# EAGLE schematic light_controller (EAGLE 9.2.2)
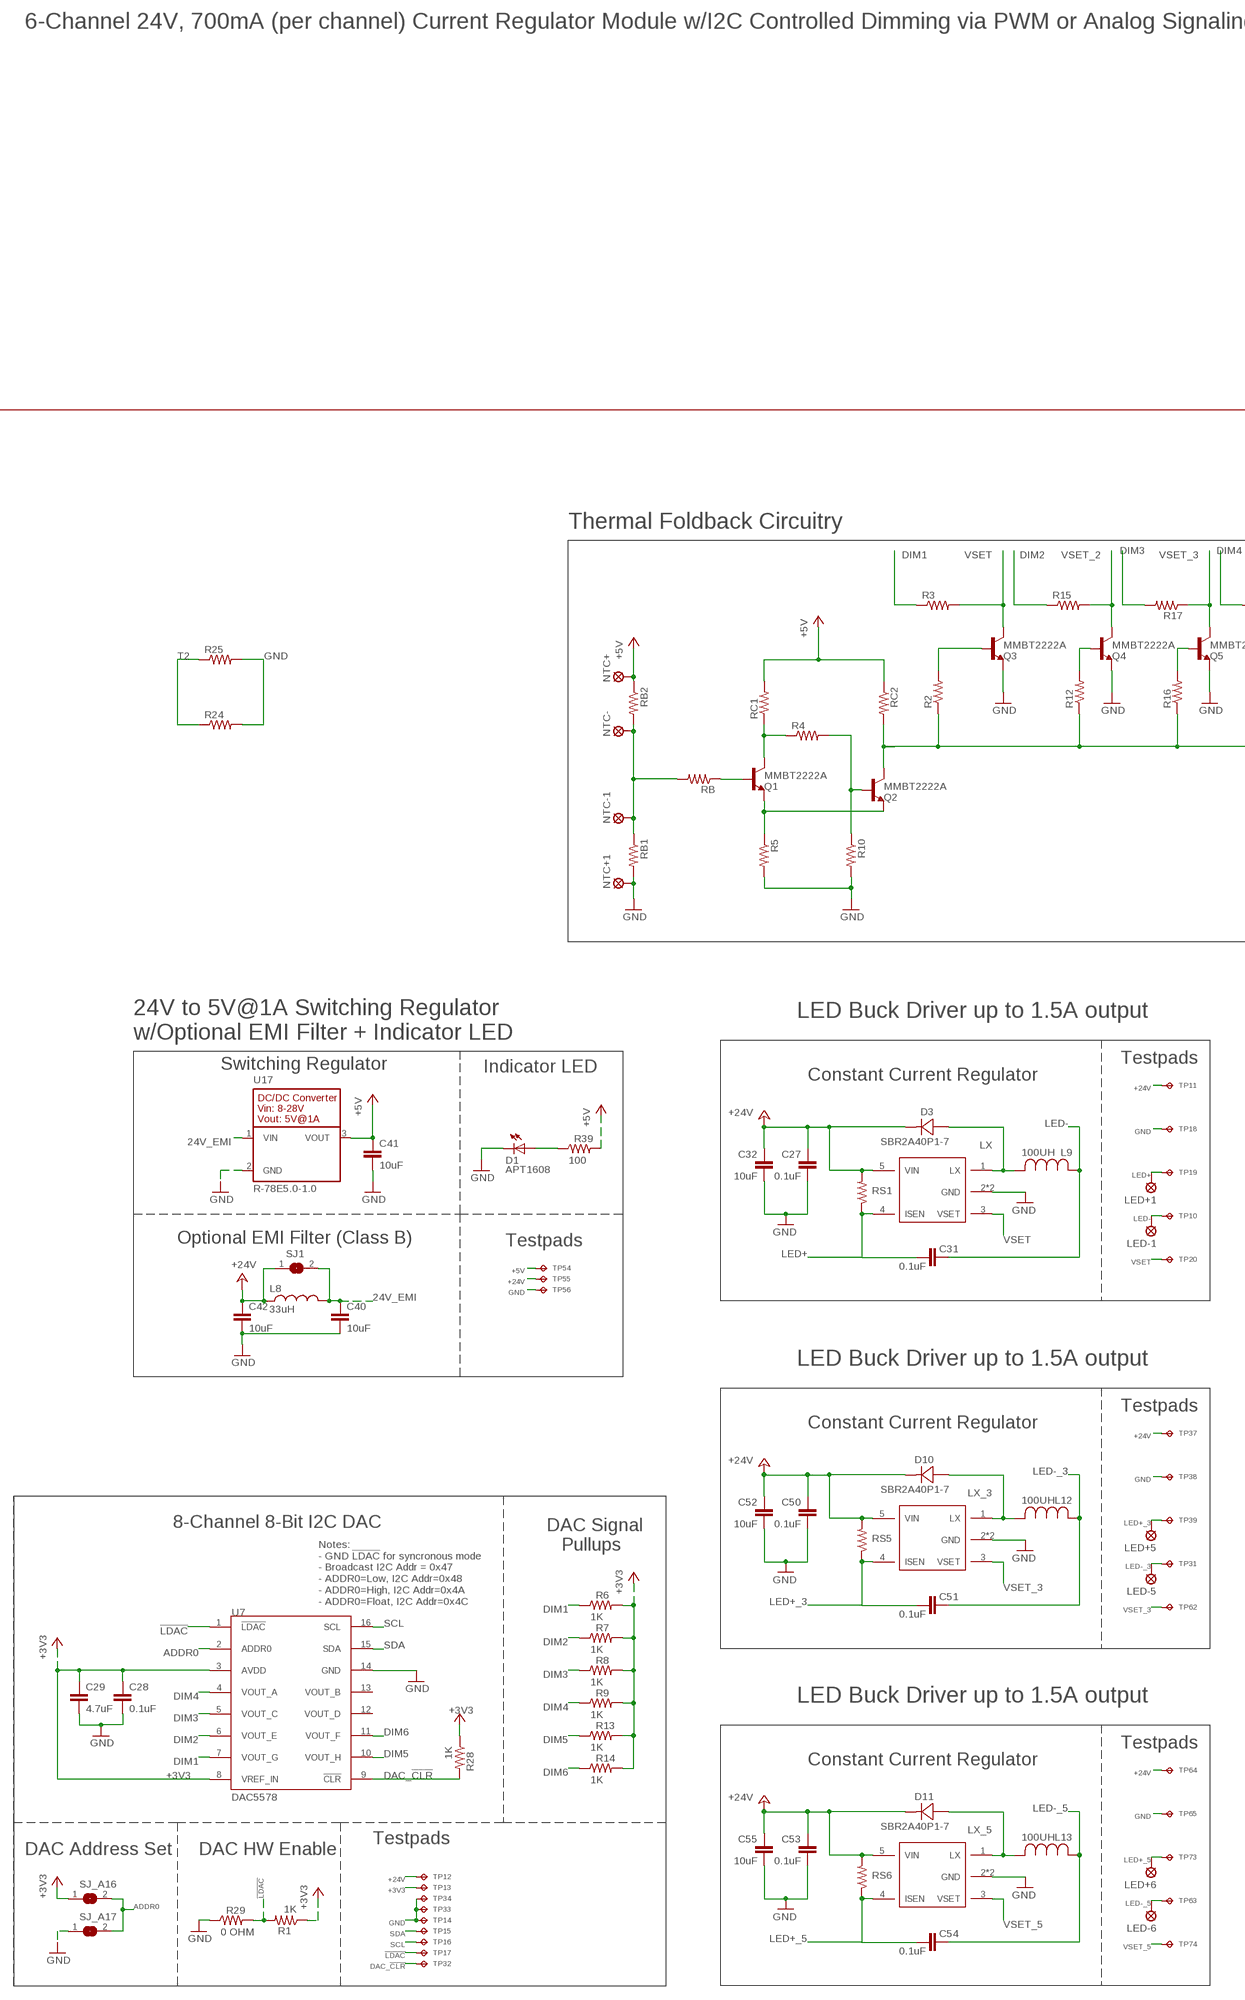
[diagram p0: schematic, sheet 1, part 1 of 2]
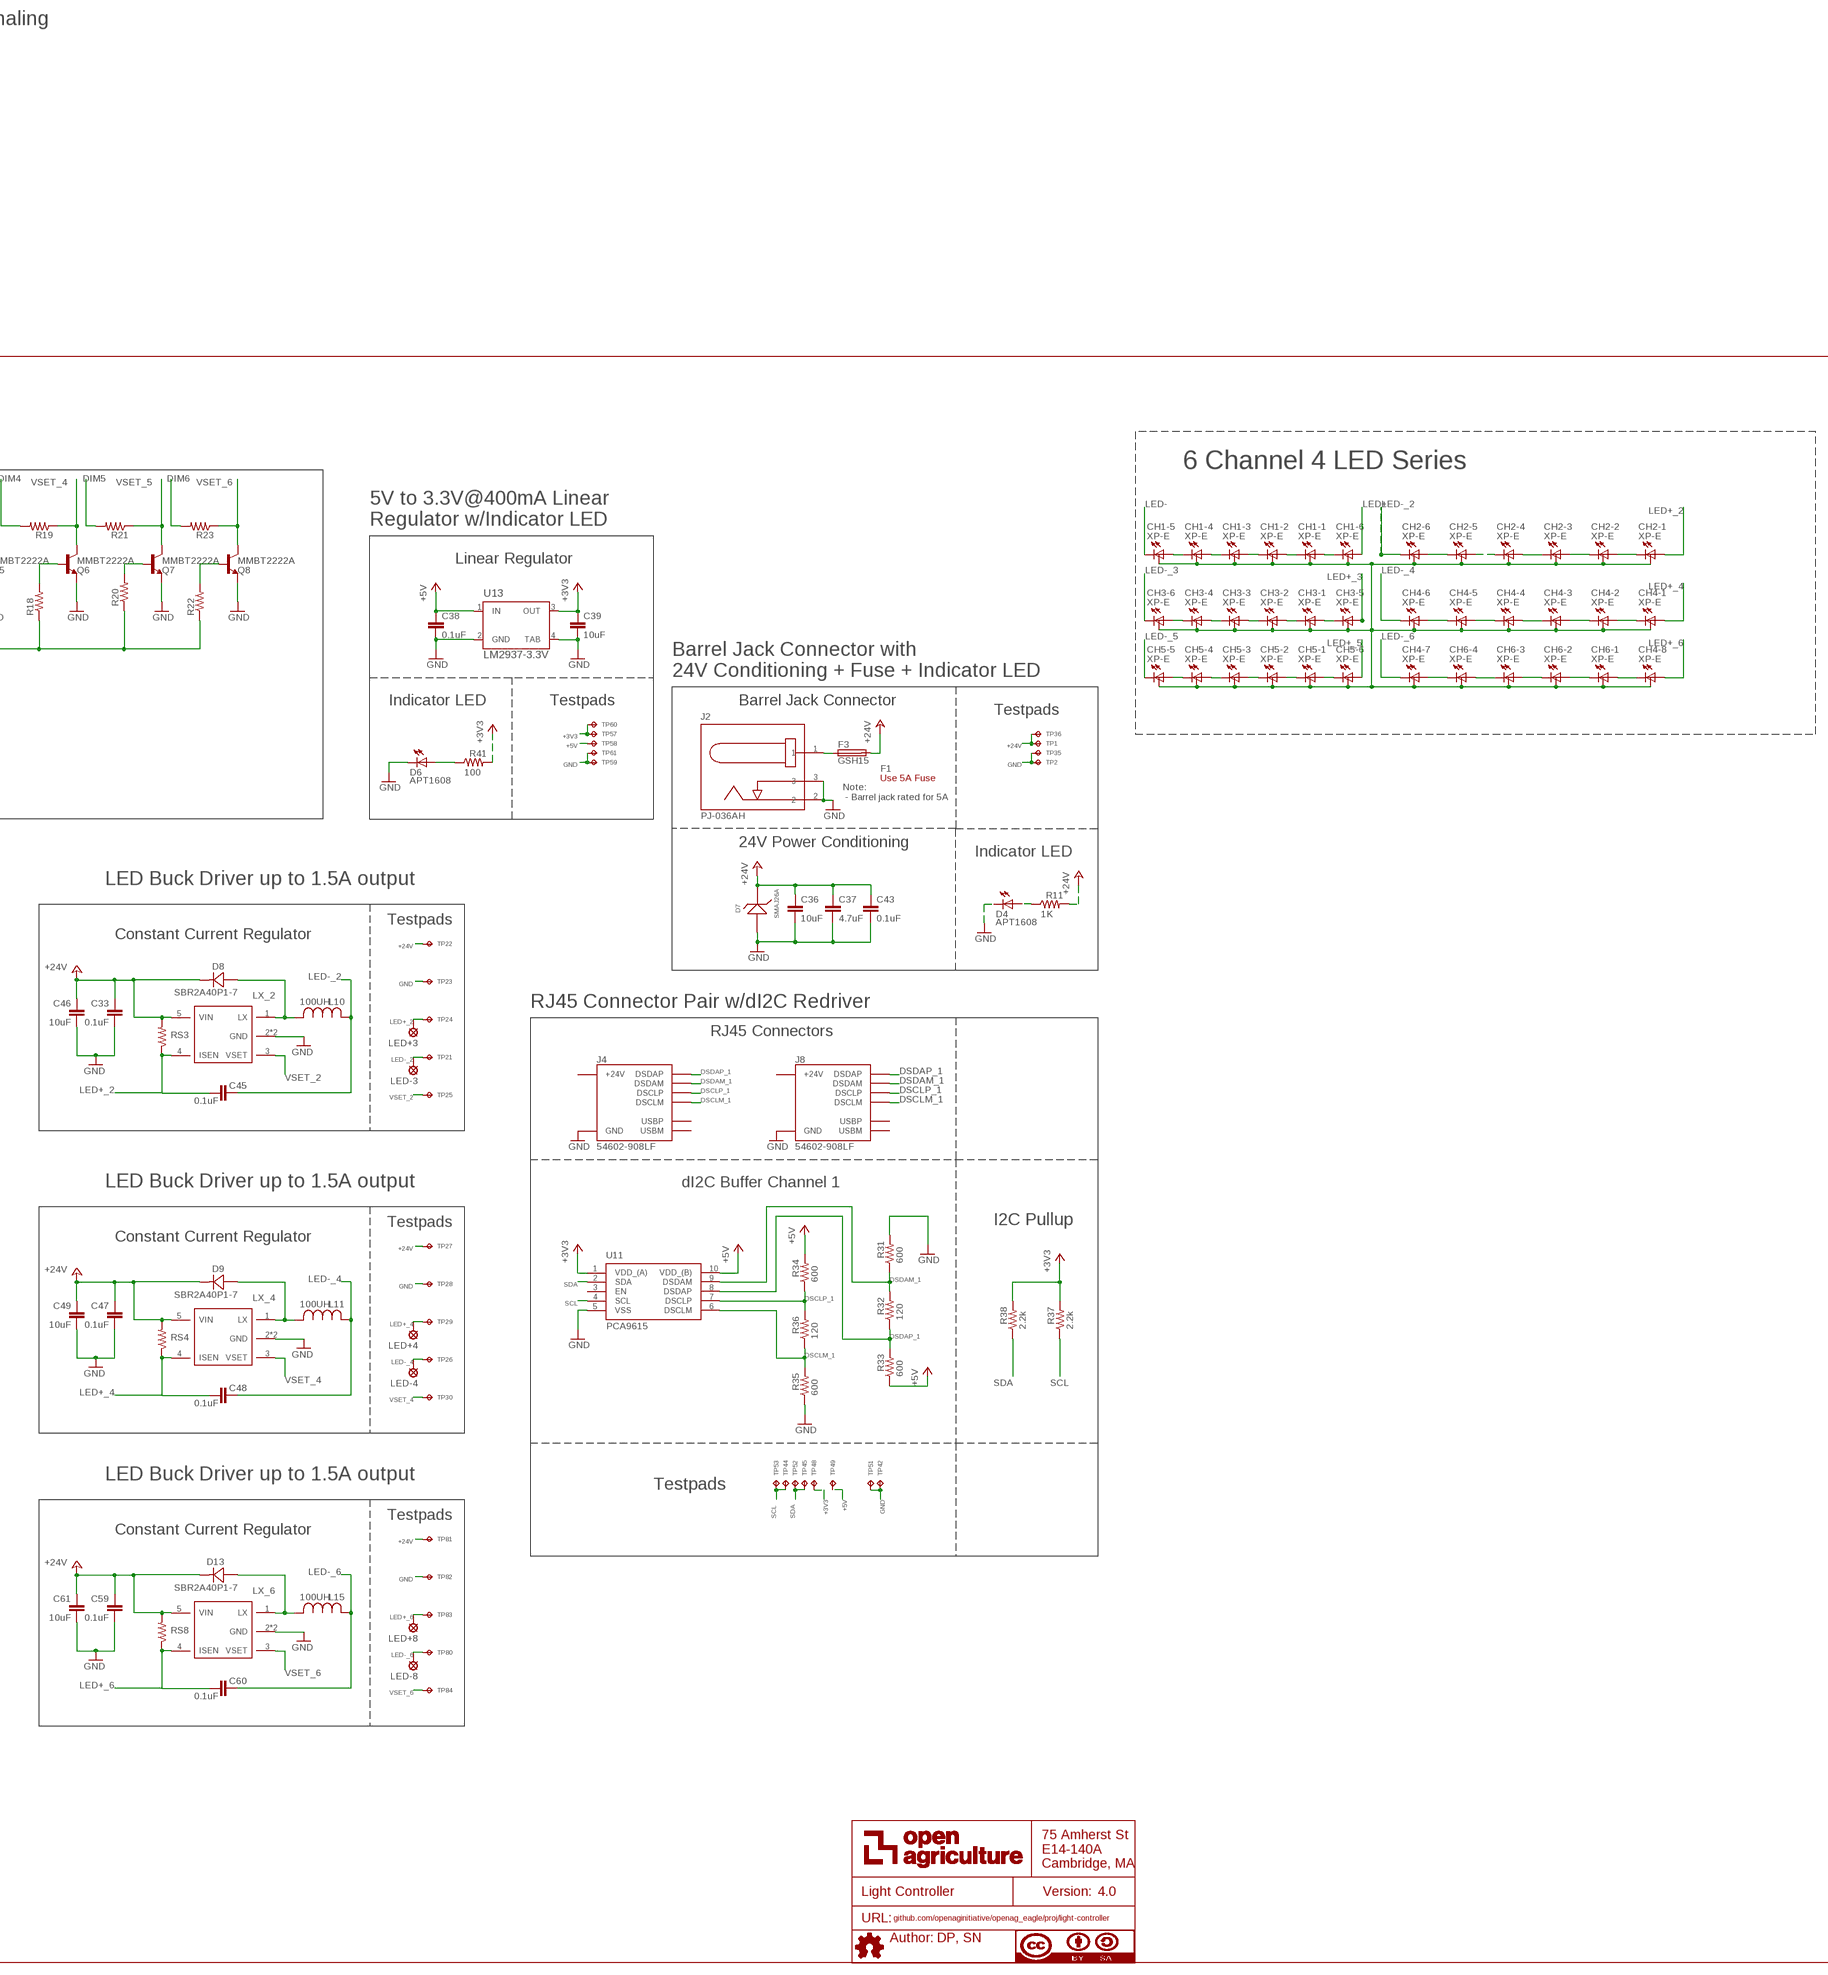
[diagram p1: schematic, sheet 1, part 2 of 2]

## Parts
C27  0.1uF  0.1UF-C0603C104K5RACTU  [C0603]
C28  0.1uF  0.1UF-C0603C104K5RACTU  [C0603]
C29  4.7uF  4.7UF-CL21A475KBQNNNE  [C0805]
C31  0.1uF  0.1UF-C0603C104K5RACTU  [C0603]
C32  10uF  10UF-GMK212BBJ106KG-T  [C0805]
C33  0.1uF  0.1UF-C0603C104K5RACTU  [C0603]
C36  10uF  10UF-GMK212BBJ106KG-T  [C0805]
C37  4.7uF  4.7UF-CL21A475KBQNNNE  [C0805]
C38  0.1uF  0.1UF-C0603C104K5RACTU  [C0603]
C39  10uF  10UF-GMK212BBJ106KG-T  [C0805]
C40  10uF  10UF-GMK212BBJ106KG-T  [C0805]
C41  10uF  10UF-GMK212BBJ106KG-T  [C0805]
C42  10uF  10UF-GMK212BBJ106KG-T  [C0805]
C43  0.1uF  0.1UF-C0603C104K5RACTU  [C0603]
C45  0.1uF  0.1UF-C0603C104K5RACTU  [C0603]
C46  10uF  10UF-GMK212BBJ106KG-T  [C0805]
C47  0.1uF  0.1UF-C0603C104K5RACTU  [C0603]
C48  0.1uF  0.1UF-C0603C104K5RACTU  [C0603]
C49  10uF  10UF-GMK212BBJ106KG-T  [C0805]
C50  0.1uF  0.1UF-C0603C104K5RACTU  [C0603]
C51  0.1uF  0.1UF-C0603C104K5RACTU  [C0603]
C52  10uF  10UF-GMK212BBJ106KG-T  [C0805]
C53  0.1uF  0.1UF-C0603C104K5RACTU  [C0603]
C54  0.1uF  0.1UF-C0603C104K5RACTU  [C0603]
C55  10uF  10UF-GMK212BBJ106KG-T  [C0805]
C59  0.1uF  0.1UF-C0603C104K5RACTU  [C0603]
C60  0.1uF  0.1UF-C0603C104K5RACTU  [C0603]
C61  10uF  10UF-GMK212BBJ106KG-T  [C0805]
CH1-1  XP-E  LED_W/THERM-XP-E  [CREE-XLAMP-XP-E]
CH1-2  XP-E  LED_W/THERM-XP-E  [CREE-XLAMP-XP-E]
CH1-3  XP-E  LED_W/THERM-XP-E  [CREE-XLAMP-XP-E]
CH1-4  XP-E  LED_W/THERM-XP-E  [CREE-XLAMP-XP-E]
CH1-5  XP-E  LED_W/THERM-XP-E  [CREE-XLAMP-XP-E]
CH1-6  XP-E  LED_W/THERM-XP-E  [CREE-XLAMP-XP-E]
CH2-1  XP-E  LED_W/THERM-XP-E  [CREE-XLAMP-XP-E]
CH2-2  XP-E  LED_W/THERM-XP-E  [CREE-XLAMP-XP-E]
CH2-3  XP-E  LED_W/THERM-XP-E  [CREE-XLAMP-XP-E]
CH2-4  XP-E  LED_W/THERM-XP-E  [CREE-XLAMP-XP-E]
CH2-5  XP-E  LED_W/THERM-XP-E  [CREE-XLAMP-XP-E]
CH2-6  XP-E  LED_W/THERM-XP-E  [CREE-XLAMP-XP-E]
CH3-1  XP-E  LED_W/THERM-XP-E  [CREE-XLAMP-XP-E]
CH3-2  XP-E  LED_W/THERM-XP-E  [CREE-XLAMP-XP-E]
CH3-3  XP-E  LED_W/THERM-XP-E  [CREE-XLAMP-XP-E]
CH3-4  XP-E  LED_W/THERM-XP-E  [CREE-XLAMP-XP-E]
CH3-5  XP-E  LED_W/THERM-XP-E  [CREE-XLAMP-XP-E]
CH3-6  XP-E  LED_W/THERM-XP-E  [CREE-XLAMP-XP-E]
CH4-1  XP-E  LED_W/THERM-XP-E  [CREE-XLAMP-XP-E]
CH4-2  XP-E  LED_W/THERM-XP-E  [CREE-XLAMP-XP-E]
CH4-3  XP-E  LED_W/THERM-XP-E  [CREE-XLAMP-XP-E]
CH4-4  XP-E  LED_W/THERM-XP-E  [CREE-XLAMP-XP-E]
CH4-5  XP-E  LED_W/THERM-XP-E  [CREE-XLAMP-XP-E]
CH4-6  XP-E  LED_W/THERM-XP-E  [CREE-XLAMP-XP-E]
CH4-7  XP-E  LED_W/THERM-XP-E  [CREE-XLAMP-XP-E]
CH4-8  XP-E  LED_W/THERM-XP-E  [CREE-XLAMP-XP-E]
CH5-1  XP-E  LED_W/THERM-XP-E  [CREE-XLAMP-XP-E]
CH5-2  XP-E  LED_W/THERM-XP-E  [CREE-XLAMP-XP-E]
CH5-3  XP-E  LED_W/THERM-XP-E  [CREE-XLAMP-XP-E]
CH5-4  XP-E  LED_W/THERM-XP-E  [CREE-XLAMP-XP-E]
CH5-5  XP-E  LED_W/THERM-XP-E  [CREE-XLAMP-XP-E]
CH5-6  XP-E  LED_W/THERM-XP-E  [CREE-XLAMP-XP-E]
CH6-1  XP-E  LED_W/THERM-XP-E  [CREE-XLAMP-XP-E]
CH6-2  XP-E  LED_W/THERM-XP-E  [CREE-XLAMP-XP-E]
CH6-3  XP-E  LED_W/THERM-XP-E  [CREE-XLAMP-XP-E]
CH6-4  XP-E  LED_W/THERM-XP-E  [CREE-XLAMP-XP-E]
D1  APT1608  APT1608CGCK  [CHIPLED_0603]
D3  SBR2A40P1-7  [POWERDI123]
D4  APT1608  APT1608CGCK  [CHIPLED_0603]
D6  APT1608  APT1608CGCK  [CHIPLED_0603]
D7  SMAJ26A  SMAJ26A-13-F  [SMA]
D8  SBR2A40P1-7  [POWERDI123]
D9  SBR2A40P1-7  [POWERDI123]
D10  SBR2A40P1-7  [POWERDI123]
D11  SBR2A40P1-7  [POWERDI123]
D13  SBR2A40P1-7  [POWERDI123]
F1  Use 5A Fuse  0217005.MXP  [FUSE-CARTRIDGE]
F3  GSH15  [GSH15]
J2  PJ-036AH  BARREL-JACK-PJ-036AH-SMT-TR  [BARREL-JACK-PJ-036AH]
J4  54602-908LF  RJ45-DI2C-USB-54602-908LFPTH  [RJ45-DI2C-USB-54602-908LF]
J8  54602-908LF  RJ45-DI2C-USB-54602-908LFPTH  [RJ45-DI2C-USB-54602-908LF]
L8  33uH  33UH-29333C  [29333C]
L9  100UH  100UH_BOURNES  [IND_BOURNS_SDR1307]
L10  100UH  100UH_BOURNES  [IND_BOURNS_SDR1307]
L11  100UH  100UH_BOURNES  [IND_BOURNS_SDR1307]
L12  100UH  100UH_BOURNES  [IND_BOURNS_SDR1307]
L13  100UH  100UH_BOURNES  [IND_BOURNS_SDR1307]
L15  100UH  100UH_BOURNES  [IND_BOURNS_SDR1307]
LED+1  SE14  [SE14]
LED+3  SE14  [SE14]
LED+4  SE14  [SE14]
LED+5  SE14  [SE14]
LED+6  SE14  [SE14]
LED+8  SE14  [SE14]
LED-1  SE14  [SE14]
LED-3  SE14  [SE14]
LED-4  SE14  [SE14]
LED-5  SE14  [SE14]
LED-6  SE14  [SE14]
LED-8  SE14  [SE14]
NTC+  SE14  [SE14]
NTC+1  SE14  [SE14]
NTC-  SE14  [SE14]
NTC-1  SE14  [SE14]
Q1  MMBT2222A  BCF30SMD  [SOT23-BEC]
Q2  MMBT2222A  BCF30SMD  [SOT23-BEC]
Q3  MMBT2222A  BCF30SMD  [SOT23-BEC]
Q4  MMBT2222A  BCF30SMD  [SOT23-BEC]
Q5  MMBT2222A  BCF30SMD  [SOT23-BEC]
Q6  MMBT2222A  BCF30SMD  [SOT23-BEC]
Q7  MMBT2222A  BCF30SMD  [SOT23-BEC]
Q8  MMBT2222A  BCF30SMD  [SOT23-BEC]
R1  1K  1K-ERJ-PB3D1001V  [RC0603N]
R2  R-US_R0805W  [R0805W]
R3  R-US_R0805W  [R0805W]
R4  R-US_R0805W  [R0805W]
R5  R-US_R0805W  [R0805W]
R6  1K  1K-ERJ-PB3D1001V  [RC0603N]
R7  1K  1K-ERJ-PB3D1001V  [RC0603N]
R8  1K  1K-ERJ-PB3D1001V  [RC0603N]
R9  1K  1K-ERJ-PB3D1001V  [RC0603N]
R10  R-US_R0805W  [R0805W]
R11  1K  1K-ERJ-PB3D1001V  [RC0603N]
R12  R-US_R0805W  [R0805W]
R13  1K  1K-ERJ-PB3D1001V  [RC0603N]
R14  1K  1K-ERJ-PB3D1001V  [RC0603N]
R15  R-US_R0805W  [R0805W]
R16  R-US_R0805W  [R0805W]
R17  R-US_R0805W  [R0805W]
R18  R-US_R0805W  [R0805W]
R19  R-US_R0805W  [R0805W]
R20  R-US_R0805W  [R0805W]
R21  R-US_R0805W  [R0805W]
R22  R-US_R0805W  [R0805W]
R23  R-US_R0805W  [R0805W]
R24  R-US_R0603  [R0603]
R25  R-US_R0603  [R0603]
R28  1K  1K-ERJ-PB3D1001V  [RC0603N]
R29  0 OHM  0OHM-RC0603JR-070RL  [RC0603N]
R31  600  600OHM-RC0603FR-07604RL  [RC0603N]
R32  120  120OHM-RC0603FR-07120RL  [RC0603N]
R33  600  600OHM-RC0603FR-07604RL  [RC0603N]
R34  600  600OHM-RC0603FR-07604RL  [RC0603N]
R35  600  600OHM-RC0603FR-07604RL  [RC0603N]
R36  120  120OHM-RC0603FR-07120RL  [RC0603N]
R37  2.2k  2.2K-RC0603JR-072K2L  [RC0603N]
R38  2.2k  2.2K-RC0603JR-072K2L  [RC0603N]
R39  100  100OHM-RC0603JR-07100RL  [RC0603N]
R41  100  100OHM-RC0603JR-07100RL  [RC0603N]
RB  R-US_R0805W  [R0805W]
RB1  R-US_R0805W  [R0805W]
RB2  R-US_R0805W  [R0805W]
RC1  R-US_R0805W  [R0805W]
RC2  R-US_R0805W  [R0805W]
RS1  6.34 ohm  6.3OHM-RC0805FR-076R34L  [R0805]
RS3  6.34 ohm  6.3OHM-RC0805FR-076R34L  [R0805]
RS4  6.34 ohm  6.3OHM-RC0805FR-076R34L  [R0805]
RS5  6.34 ohm  6.3OHM-RC0805FR-076R34L  [R0805]
RS6  6.34 ohm  6.3OHM-RC0805FR-076R34L  [R0805]
RS8  6.34 ohm  6.3OHM-RC0805FR-076R34L  [R0805]
SJ1  EMI-BYPASS  [EMI-BYPASS]
SJ_A16  SOLDERJUMPERREFLOW_NOPASTE  [SJ1]
SJ_A17  SOLDERJUMPERREFLOW_NOPASTE  [SJ1]
TP1  TPTP04R  [TP04R]
TP2  TPTP04R  [TP04R]
TP10  TPTP06R  [TP06R]
TP11  TPTP06R  [TP06R]
TP12  TPTP04R  [TP04R]
TP13  TPTP04R  [TP04R]
TP14  TPTP04R  [TP04R]
TP15  TPTP04R  [TP04R]
TP16  TPTP04R  [TP04R]
TP17  TPTP04R  [TP04R]
TP18  TPTP06R  [TP06R]
TP19  TPTP06R  [TP06R]
TP20  TPTP06R  [TP06R]
TP21  TPTP06R  [TP06R]
TP22  TPTP06R  [TP06R]
TP23  TPTP06R  [TP06R]
TP24  TPTP06R  [TP06R]
TP25  TPTP06R  [TP06R]
TP26  TPTP06R  [TP06R]
TP27  TPTP06R  [TP06R]
TP28  TPTP06R  [TP06R]
TP29  TPTP06R  [TP06R]
TP30  TPTP06R  [TP06R]
TP31  TPTP06R  [TP06R]
TP32  TPTP04R  [TP04R]
TP33  TPTP04R  [TP04R]
TP34  TPTP04R  [TP04R]
TP35  TPTP04R  [TP04R]
TP36  TPTP04R  [TP04R]
TP37  TPTP06R  [TP06R]
TP38  TPTP06R  [TP06R]
TP39  TPTP06R  [TP06R]
TP42  TPTP04R  [TP04R]
TP44  TPTP04R  [TP04R]
TP45  TPTP04R  [TP04R]
TP48  TPTP04R  [TP04R]
TP49  TPTP04R  [TP04R]
TP51  TPTP04R  [TP04R]
TP52  TPTP04R  [TP04R]
TP53  TPTP04R  [TP04R]
TP54  TPTP06R  [TP06R]
TP55  TPTP06R  [TP06R]
TP56  TPTP06R  [TP06R]
TP57  TPTP04R  [TP04R]
TP58  TPTP04R  [TP04R]
TP59  TPTP04R  [TP04R]
TP60  TPTP04R  [TP04R]
TP61  TPTP04R  [TP04R]
TP62  TPTP06R  [TP06R]
TP63  TPTP06R  [TP06R]
TP64  TPTP06R  [TP06R]
TP65  TPTP06R  [TP06R]
TP73  TPTP06R  [TP06R]
TP74  TPTP06R  [TP06R]
TP80  TPTP06R  [TP06R]
TP81  TPTP06R  [TP06R]
TP82  TPTP06R  [TP06R]
TP83  TPTP06R  [TP06R]
TP84  TPTP06R  [TP06R]
U7  DAC5578  DAC5578SPW  [TSSOP16]
U11  PCA9615  PCA9615DPJ  [SOP50P490X110-10N]
U13  LM2937-3.3V  LM2937IMP-3.3/NOPB  [MP04A]
U17  R-78E5.0-1.0  [R-78E5.0-1.0]
U$6  AUTHOR  [AUTHOR]
U$7  TITLE  [TITLE]
U$11  AL8861  [AL8861]
U$12  AL8861  [AL8861]
U$13  AL8861  [AL8861]
U$14  AL8861  [AL8861]
U$15  AL8861  [AL8861]
U$17  AL8861  [AL8861]

## Nets
24V_EMI: C40.1 L8.2 SJ1.2 U17.1(VIN)
24V_IN: F3.1 J2.1
!LDAC!: R1.2 R29.2 TP17.1(TP) U7.1(!LDAC!)
+3V3: C28.1 C29.1 C39.1 R1.1 R6.2 R7.2 R8.2 R9.2 R13.2 R14.2 R28.1 R37.2 R38.2 R41.2 SJ_A16.1 TP13.1(TP) TP48.1(TP) TP57.1(TP) TP60.1(TP) U7.3(AVDD) U7.8(VREF_IN) U11.1(VDD_(A)) U13.3(OUT)
+5V: C38.1 C41.1 NTC+.MP R33.1 R34.2 R39.2 RB2.1 RC1.2 RC2.1 TP49.1(TP) TP54.TP TP58.1(TP) U11.10(VDD_(B)) U13.1(IN) U17.3(VOUT)
+24V: C27.1 C32.1 C33.1 C36.1 C37.1 C42.1 C43.1 C46.1 C47.1 C49.1 C50.1 C52.1 C53.1 C55.1 C59.1 C61.1 D3.- D7.1 D8.- D9.- D10.- D11.- D13.- F3.2 L8.1 R11.2 RS1.2 RS3.2 RS4.2 RS5.2 RS6.2 RS8.2 SJ1.1 TP1.1(TP) TP11.TP TP12.1(TP) TP22.TP TP27.TP TP36.1(TP) TP37.TP TP55.TP TP64.TP TP81.TP U$11.5(VIN) U$12.5(VIN) U$13.5(VIN) U$14.5(VIN) U$15.5(VIN) U$17.5(VIN)
ADDR0: SJ_A16.2 SJ_A17.2 U7.2(ADDR0)
DAC_!CLR!: R28.2 TP32.1(TP) U7.9(!CLR!)
DIM1: R3.1 R6.1 U7.7(VOUT_G)
DIM2: R7.1 R15.1 U7.6(VOUT_E)
DIM3: R8.1 R17.2 U7.5(VOUT_C)
DIM4: R9.1 R19.2 U7.4(VOUT_A)
DIM5: R13.1 R21.2 U7.10(VOUT_H)
DIM6: R14.1 R23.2 U7.11(VOUT_F)
DSCLM_1: J4.DSCLM(5)(DSCLM) J8.DSCLM(5)(DSCLM) R35.2 R36.1 U11.6(DSCLM)
DSCLP_1: J4.DSCLP(4)(DSCLP) J8.DSCLP(4)(DSCLP) R34.1 R36.2 U11.7(DSCLP)
DSDAM_1: J4.DSDAM(2)(DSDAM) J8.DSDAM(2)(DSDAM) R31.1 R32.2 U11.9(DSDAM)
DSDAP_1: J4.DSDAP(1)(DSDAP) J8.DSDAP(1)(DSDAP) R32.1 R33.2 U11.8(DSDAP)
GND: C27.2 C28.2 C29.2 C32.2 C33.2 C36.2 C37.2 C38.2 C39.2 C40.2 C41.2 C42.2 C43.2 C46.2 C47.2 C49.2 C50.2 C52.2 C53.2 C55.2 C59.2 C61.2 D1.C D4.C D6.C D7.2 J2.2 J2.3 J4.GND(3)(GND) J8.GND(3)(GND) NTC+1.MP Q3.E Q4.E Q5.E Q6.E Q7.E Q8.E R5.2 R10.2 R24.2 R25.2 R29.1 R31.2 R35.1 RB1.2 SJ_A17.1 TP2.1(TP) TP14.1(TP) TP18.TP TP23.TP TP28.TP TP33.1(TP) TP34.1(TP) TP35.1(TP) TP38.TP TP42.1(TP) TP51.1(TP) TP56.TP TP59.1(TP) TP61.1(TP) TP65.TP TP82.TP U7.14(GND) U11.5(VSS) U13.2(GND) U13.4(TAB) U17.2(GND) U$11.2(GND) U$11.44(GND) U$12.2(GND) U$12.44(GND) U$13.2(GND) U$13.44(GND) U$14.2(GND) U$14.44(GND) U$15.2(GND) U$15.44(GND) U$17.2(GND) U$17.44(GND)
LED+: C31.2 CH1-6.A CH1-6.A@1(A) LED+1.MP RS1.1 TP19.TP U$11.4(ISEN)
LED+_2: C45.2 CH2-1.A CH2-1.A@1(A) LED+3.MP RS3.1 TP24.TP U$12.4(ISEN)
LED+_3: C51.2 CH3-5.A CH3-5.A@1(A) LED+5.MP RS5.1 TP39.TP U$14.4(ISEN)
LED+_4: C48.2 CH4-1.A CH4-1.A@1(A) LED+4.MP RS4.1 TP29.TP U$13.4(ISEN)
LED+_5: C54.2 CH5-6.A CH5-6.A@1(A) LED+6.MP RS6.1 TP73.TP U$15.4(ISEN)
LED+_6: C60.2 CH4-8.A CH4-8.A@1(A) LED+8.MP RS8.1 TP83.TP U$17.4(ISEN)
LED-: C31.1 CH1-5.C CH1-5.C@1(C) L9.2 LED-1.MP TP10.TP
LED-_2: C45.1 CH2-6.C CH2-6.C@1(C) L10.2 LED-3.MP TP21.TP
LED-_3: C51.1 CH3-6.C CH3-6.C@1(C) L12.2 LED-5.MP TP31.TP
LED-_4: C48.1 CH4-6.C CH4-6.C@1(C) L11.2 LED-4.MP TP26.TP
LED-_5: C54.1 CH5-5.C CH5-5.C@1(C) L13.2 LED-6.MP TP63.TP
LED-_6: C60.1 CH4-7.C CH4-7.C@1(C) L15.2 LED-8.MP TP80.TP
LX: D3.+ L9.1 U$11.1(LX)
LX_2: D8.+ L10.1 U$12.1(LX)
LX_3: D10.+ L12.1 U$14.1(LX)
LX_4: D9.+ L11.1 U$13.1(LX)
LX_5: D11.+ L13.1 U$15.1(LX)
LX_6: D13.+ L15.1 U$17.1(LX)
N$1: D1.A R39.1
N$2: CH2-4.C CH2-4.C@1(C) CH2-5.A CH2-5.A@1(A)
N$3: D6.A R41.1
N$4: D4.A R11.1
N$5: Q1.B RB.1
N$6: Q1.C R4.1 RC1.1
N$7: Q1.E Q2.E R5.1
N$8: Q3.B R2.2
N$9: Q2.B R4.2 R10.1
N$10: Q4.B R12.2
N$11: Q2.C R2.1 R12.1 R16.1 R18.1 R20.1 R22.1 RC2.2
N$12: Q5.B R16.2
N$22: Q6.B R18.2
N$23: Q7.B R20.2
N$24: Q8.B R22.2
N$25: NTC-1.MP NTC-.MP RB1.1 RB2.2 RB.2
N$26: CH2-3.C CH2-3.C@1(C) CH2-4.A CH2-4.A@1(A)
N$30: CH2-2.C CH2-2.C@1(C) CH2-3.A CH2-3.A@1(A)
N$31: CH2-5.C CH2-5.C@1(C) CH2-6.A CH2-6.A@1(A)
N$32: CH4-4.C CH4-4.C@1(C) CH4-5.A CH4-5.A@1(A)
N$33: CH4-5.C CH4-5.C@1(C) CH4-6.A CH4-6.A@1(A)
N$34: CH4-7.A CH4-7.A@1(A) CH6-4.C CH6-4.C@1(C)
N$35: CH4-8.C CH4-8.C@1(C) CH6-1.A CH6-1.A@1(A)
N$36: CH1-4.C CH1-4.C@1(C) CH1-5.A CH1-5.A@1(A)
N$37: CH1-3.C CH1-3.C@1(C) CH1-4.A CH1-4.A@1(A)
N$38: CH2-1.C CH2-1.C@1(C) CH2-2.A CH2-2.A@1(A)
N$39: CH4-3.C CH4-3.C@1(C) CH4-4.A CH4-4.A@1(A)
N$40: CH4-2.C CH4-2.C@1(C) CH4-3.A CH4-3.A@1(A)
N$41: CH4-1.C CH4-1.C@1(C) CH4-2.A CH4-2.A@1(A)
N$42: CH6-3.C CH6-3.C@1(C) CH6-4.A CH6-4.A@1(A)
N$43: CH6-2.C CH6-2.C@1(C) CH6-3.A CH6-3.A@1(A)
N$44: CH6-1.C CH6-1.C@1(C) CH6-2.A CH6-2.A@1(A)
N$45: CH1-2.C CH1-2.C@1(C) CH1-3.A CH1-3.A@1(A)
N$46: CH1-1.C CH1-1.C@1(C) CH1-2.A CH1-2.A@1(A)
N$47: CH1-1.A CH1-1.A@1(A) CH1-6.C CH1-6.C@1(C)
N$48: CH3-4.C CH3-4.C@1(C) CH3-6.A CH3-6.A@1(A)
N$49: CH3-3.C CH3-3.C@1(C) CH3-4.A CH3-4.A@1(A)
N$50: CH3-2.C CH3-2.C@1(C) CH3-3.A CH3-3.A@1(A)
N$51: CH3-1.C CH3-1.C@1(C) CH3-2.A CH3-2.A@1(A)
N$52: CH3-1.A CH3-1.A@1(A) CH3-5.C CH3-5.C@1(C)
N$53: CH5-4.C CH5-4.C@1(C) CH5-5.A CH5-5.A@1(A)
N$54: CH5-3.C CH5-3.C@1(C) CH5-4.A CH5-4.A@1(A)
N$55: CH5-2.C CH5-2.C@1(C) CH5-3.A CH5-3.A@1(A)
N$56: CH5-1.C CH5-1.C@1(C) CH5-2.A CH5-2.A@1(A)
N$57: CH5-1.A CH5-1.A@1(A) CH5-6.C CH5-6.C@1(C)
SCL: R37.1 TP16.1(TP) TP44.1(TP) TP53.1(TP) U7.16(SCL) U11.4(SCL)
SDA: R38.1 TP15.1(TP) TP45.1(TP) TP52.1(TP) U7.15(SDA) U11.2(SDA)
T2: CH1-1.THERM CH1-2.THERM CH1-3.THERM CH1-4.THERM CH1-5.THERM CH1-6.THERM CH2-1.THERM CH2-2.THERM CH2-3.THERM CH2-4.THERM CH2-5.THERM CH2-6.THERM CH3-1.THERM CH3-2.THERM CH3-3.THERM CH3-4.THERM CH3-5.THERM CH3-6.THERM CH4-1.THERM CH4-2.THERM CH4-3.THERM CH4-4.THERM CH4-5.THERM CH4-6.THERM CH4-7.THERM CH4-8.THERM CH5-1.THERM CH5-2.THERM CH5-3.THERM CH5-4.THERM CH5-5.THERM CH5-6.THERM CH6-1.THERM CH6-2.THERM CH6-3.THERM CH6-4.THERM R24.1 R25.1
VSET: Q3.C R3.2 TP20.TP U$11.3(VSET)
VSET_2: Q4.C R15.2 TP25.TP U$12.3(VSET)
VSET_3: Q5.C R17.1 TP62.TP U$14.3(VSET)
VSET_4: Q6.C R19.1 TP30.TP U$13.3(VSET)
VSET_5: Q7.C R21.1 TP74.TP U$15.3(VSET)
VSET_6: Q8.C R23.1 TP84.TP U$17.3(VSET)
Unconnected: J4.24V(6)(+24V) J4.USBM(8)(USBM) J4.USBP(7)(USBP) J8.24V(6)(+24V) J8.USBM(8)(USBM) J8.USBP(7)(USBP) U7.12(VOUT_D) U7.13(VOUT_B) U11.3(EN)

## Notes on the sheet
- 6-Channel 24V, 700mA (per channel) Current Regulator Module w/I2C Controlled Dimming via PWM or Analog Signaling
- Thermal Foldback Circuitry
- 6 Channel 4 LED Series
- 5V to 3.3V@400mA Linear 
  Regulator w/Indicator LED
- Linear Regulator
- Barrel Jack Connector with
  24V Conditioning + Fuse + Indicator LED
- Indicator LED | Testpads | Barrel Jack Connector
- Testpads
- Note:
   - Barrel jack rated for 5A
- 24V Power Conditioning
- Indicator LED
- LED Buck Driver up to 1.5A output | LED Buck Driver up to 1.5A output
- 24V to 5V@1A Switching Regulator
  w/Optional EMI Filter + Indicator LED
- Testpads | Testpads
- Switching Regulator | Indicator LED
- Constant Current Regulator | Constant Current Regulator
- RJ45 Connector Pair w/dI2C Redriver
- RJ45 Connectors
- Optional EMI Filter (Class B) | Testpads
- LED Buck Driver up to 1.5A output | LED Buck Driver up to 1.5A output | dI2C Buffer Channel 1
- Testpads | Testpads | I2C Pullup
- Constant Current Regulator | Constant Current Regulator
- 8-Channel 8-Bit I2C DAC
- DAC Signal 
     Pullups
- Notes:
  - GND !LDAC! for syncronous mode
  - Broadcast I2C Addr = 0x47
  - ADDR0=Low, I2C Addr=0x48
  - ADDR0=High, I2C Addr=0x4A
  - ADDR0=Float, I2C Addr=0x4C
- LED Buck Driver up to 1.5A output | LED Buck Driver up to 1.5A output
- Testpads
- Testpads | Testpads
- Constant Current Regulator | Constant Current Regulator
- Testpads
- DAC Address Set | DAC HW Enable

## Library data of the parts
C27 C28 C31 C33 C38 C43 C45 C47 C48 C50 C51 C53 C54 C59 C60 = openag-capacitors:0.1UF-C0603C104K5RACTU: CAP CER 0.1UF 50V X7R 0603 Description: 0.1µF ±10% 50V Ceramic Capacitor X7R 0603 (1608 Metric) Technical Specifications: Capacitance: 0.1µF Tolerance: ±10% Rated Voltage: 50V Temperature Coefficient: X7R Operating Temperature: -55°C ~ 125°C Package / Case: 0603 (1608 Metric) Datasheet(s): X7R Dielectric, 6.3-250 VDC Vendor(s): Digikey: 399-5089-1-ND; MANUFACTURER: Kemet; MPN: C0603C104K5RACTU; VENDOR: Digikey; VLINK: https://www.digikey.com/product-detail/en/kemet/C0603C104K5RACTU/399-5089-1-ND/1465623; VPN: 399-5089-1-ND
C29 C37 = openag-capacitors:4.7UF-CL21A475KBQNNNE: CAP CER 4.7UF 50V X5R 0805 Description: 4.7µF ±10% 50V Ceramic Capacitor X5R 0805 (2012 Metric) Technical Specifications: Capacitance: 4.7uF Tolerance: ±10% Rated Voltage: 50V Temperature Coefficient: X5R Operating Temperature: -55°C ~ 85°C Package/Case: 0805 (2012 Metric) Datasheet(s): CL21A475KBQNNNE Characteristics Vendor(s): Digikey: 1276-1248-1-ND; MANUFACTURER: Samsung; MPN: CL21A475KBQNNNE; VENDOR: Digikey; VLINK: https://www.digikey.com/product-detail/en/samsung-electro-mechanics/CL21A475KBQNNNE/1276-1248-1-ND/3889334; VPN: 1276-1248-1-ND
C32 C36 C39-C42 C46 C49 C52 C55 C61 = openag-capacitors:10UF-GMK212BBJ106KG-T: CAP CER 10UF 35V X5R 0805 Description: 10µF ±10% 35V Ceramic Capacitor X5R 0805 (2012 Metric) Technical Specifications: Capacitance: 10µF Tolerance: ±10% Rated Voltage: 35V Temperature Coefficient: X5R Operating Temperature: -55°C ~ 85°C Package / Case: 0805 (2012 Metric) Datasheet(s): GMK212BBJ106KG-T Spec Vendor(s): Digikey: 587-4893-1-ND; MANUFACTURER: Taiyo Yuden; MPN: GMK212BBJ106KG-T; VENDOR: Digikey; VLINK: https://www.digikey.com/product-detail/en/taiyo-yuden/GMK212BBJ106KG-T/587-4893-1-ND/6563736; VPN: 587-4893-1-ND
CH1-1-CH1-6 CH2-1-CH2-6 CH3-1-CH3-6 CH4-1-CH4-8 CH5-1-CH5-6 CH6-1-CH6-4 = Tomaszewski:LED_W/THERM
D1 D4 D6 = openag-diodes:APT1608CGCK: LED GREEN CLEAR 0603 SMD Description: Green 570nm LED Indication - Discrete 2.1V 0603 (1608 Metric) Technical Specifications: Color: Green Lens Color: Colorless Lens Transparency: Clear Millicandela Rating: 50mcd Lens Style/Size: Rectangle with Flat Top, 1.20mm x 0.80mm Voltage - Forward (Vf) (Typ): 2.1V Current - Test: 20mA Viewing Angle: 120° Mounting Type: Surface Mount Wavelength - Dominant: 570nm Wavelength - Peak: 574nm Package / Case: 0603 (1608 Metric) Supplier Device Package: Chip LED Size / Dimension: 1.60mm L x 0.80mm W Height (Max): 0.75mm Datasheet(s): APT1608CGCK Vendor(s): Digikey: 754-1116-1-ND; MANUFACTURER: Kingbright; MPN: APT1608CGCK; VENDOR: Digikey; VLINK: https://www.digikey.com/product-detail/en/kingbright/APT1608CGCK/754-1116-1-ND/1747833#; VPN: 754-1116-1-ND
D3 D8-D11 D13 = openag-diodes:SBR2A40P1-7: DIODE SBR 40V 2A POWERDI123 Description: Diode Super Barrier 40V 2A Surface Mount PowerDI™ 123 Technical Specifications: Diode Type: Super Barrier Voltage - DC Reverse (Vr) (Max): 40V Current - Average Rectified (Io): 2A Voltage - Forward (Vf) (Max) @ If: 500mV @ 2A Speed: Standard Recovery >500ns, > 200mA (Io) Current - Reverse Leakage @ Vr: 100µA @ 40V Mounting Type: Surface Mount Package / Case: POWERDI®123 Supplier Device Package: PowerDI™ 123 Operating Temperature - Junction: -65°C ~ 150°C Base Part Number: SBR2A40 Datasheet(s): SBR2A40P1 Vendor(s): Digikey: SBR2A40P1DITR-ND; MANUFACTURER: Diodes Incorporated; MPN: SBR2A40P1-7; VENDOR: Digikey; VLINK: https://www.digikey.com/product-detail/en/diodes-incorporated/SBR2A40P1-7/SBR2A40P1DITR-ND/1681825; VPN: SBR2A40P1DITR-ND
D7 = openag-diodes:SMAJ26A-13-F: TVS DIODE 26VWM 42.1VC SMA Description: TVS DIODE 26VWM 42.1VC SMA Technical Specifications: Type: Zener Voltage - Reverse Standoff (Typ): 26V Voltage - Breakdown (Min): 28.9V Voltage - Clamping (Max) @ Ipp: 42.1V Current - Peak Pulse (10/1000µs): 9.5A Power - Peak Pulse: 400W Power Line Protection: No Operating Temperature: -55°C ~ 150°C (TJ) DO-214AC, SMA Datasheet(s): SMAJ5.0(C)A - SMAJ200(C)A Vendor(s): Digikey: SMAJ26A-FDICT-ND; MANUFACTURER: Diodes Incorporated; MPN: SMAJ26A-13-F; VENDOR: Digikey; VLINK: https://www.digikey.com/product-detail/en/diodes-incorporated/SMAJ26A-13-F/SMAJ26A-FDICT-ND/806583; VPN: SMAJ26A-FDICT-ND
F1 = openag-fuses:0217005.MXP: FUSE GLASS 5A 250VAC 5X20MM Description: FUSE GLASS 5A 250VAC 5X20MM Technical Specifications: Fuse Type: Cartridge, Glass Current Rating: 5A Voltage Rating - AC: 250V Response Time: Fast Package / Case: 5mm x 20mm Mounting Type: Holder Breaking Capacity @ Rated Voltage: 50A Melting I²t: 42.795 Approvals: BSI, CE, CCC, CSA, KC, PSE, SEMKO, UR, VDE Operating Temperature: -55°C ~ 125°C Size / Dimension: 0.205" Dia x 0.787" L (5.20mm x 20.00mm) DC Cold Resistance: 0.0137 Ohms Datasheet(s): 217 Series Datasheet Vendor(s): Digikey: F1725-ND; MANUFACTURER: Littelfuse Inc.; MPN: 0217005.MXP; VENDOR: Digikey; VLINK: https://www.digikey.com/product-detail/en/littelfuse-inc/0217005.MXP/F1725-ND/777549; VPN: F1725-ND
F3 = openag-fuses:GSH15: FUSE BLOCK CART 250V 6.3A PCB Description: Fuse Block 6.3A 250V 1 Circuit Cartridge PCB Technical Specifications: Fuseholder Type: Block Fuse Type: Cartridge For Use With/Related Products: 5mm x 20mm Fuse Size: 5mm x 20mm Number of Circuits: 1 Voltage: 250V Current Rating: 6.3A Mounting Type: PCB Orientation: Horizontal Termination Style: PC Pin Contact Material: Copper Alloy Contact Finish: Tin Datasheet(s): 649 Series Vendor(s): Digikey: WK0011-ND; MANUFACTURER: Littelfuse Inc.; MPN: 64900001039; VENDOR: Digikey; VLINK: https://www.digikey.com/product-detail/en/littelfuse-inc/64900001039/WK0011-ND/245470; VPN: WK0011-ND
J2 = openag-connectors:BARREL-JACK-PJ-036AH-SMT-TR: CONN PWR JACK 2X5.5MM SOLDER Description: Power Barrel Connector Jack 2.10mm ID (0.083"), 5.50mm OD (0.217") Surface Mount, Right Angle Technical Specifications: Connector Type: Jack Gender: Male Industry Recognized Mating Diameter: 2.10mm ID (0.083"), 5.50mm OD (0.217") Actual Diameter: 0.078" (2.00mm ID), 0.248" (6.30mm OD) Number of Positions/Contacts: 2 Conductors, 3 Contacts Internal Switch(s): Single Switch, Normally Closed Mounting Type: Surface Mount, Right Angle Termination: Solder Shielding: Unshielded Voltage - Rated: 24VDC Current Rating: 5A Mating Length/Depth: 0.360" (9.15mm) Contact Material - Plating: Silver Operating Temperature: -25°C ~ 85°C Housing Material: Polyamide (PA6T), Nylon 6T Contact Material: Brass; Copper Alloy Body Color: Black Datasheet(s): PJ-036AH-SMT-TR Vendor(s): Digikey: CP-036AHPJCT-ND; MANUFACTURER: CUI Inc.; MPN: PJ-036AH-SMT-TR; VENDOR: Digikey; VLINK: https://www.digikey.com/product-detail/en/cui-inc/PJ-036AH-SMT-TR/CP-036AHPJCT-ND/1530994; VPN: CP-036AHPJCT-ND
J4 J8 = openag-connectors:RJ45-DI2C-USB-54602-908LF: CONN MOD JACK 8P8C R/A UNSHLD Description: Jack Modular Connector 8p8c (RJ45, Ethernet) 90° Angle (Right) Unshielded Cat3 Technical Specifications: Connector Type: Jack Number of Positions/Contacts: 8p8c (RJ45, Ethernet) Number of Ports: 1 Number of Rows: 1 Mounting Type: Through Hole Orientation: 90° Angle (Right) Termination: Solder Shielding: Unshielded Ratings: Cat3 Features: Board Lock LED Color: Does Not Contain LED Tab Direction: Down Contact Material: Copper Alloy Contact Finish: Gold Contact Finish Thickness: 15µin (0.38µm) Housing Material: Polyester, Glass Filled Operating Temperature: -40°C ~ 70°C Datasheet(s): 54601-x04(zzz)WPLF Drawing Vendor(s): Digikey: 609-1046-ND; MANUFACTURER: Amphenol FCI; MPN: 54602-908LF; VENDOR: Digikey; VLINK: https://www.digikey.com/product-detail/en/amphenol-fci/54602-908LF/609-1046-ND/1001360; VPN: 609-1046-ND
L8 = openag-inductors:33UH-29333C: FIXED IND 33UH 1A 120 MOHM SMD Description: 33µH Shielded Wirewound Inductor 1A 120 mOhm Max Nonstandard Technical Specifications: Type: Wirewound Inductance: 33µH Current Rating: 1A Shielding: Shielded DC Resistance (DCR): 120 mOhm Max Operating Temperature: -40°C ~ 85°C Frequency - Test: 10kHz Mounting Type: Surface Mount Package / Case: Nonstandard Size / Dimension: 0.283" L x 0.283" W (7.20mm x 7.20mm) Height - Seated (Max): 0.157" (4.00mm) Datasheet(s): 2900 Series Vendor(s): Digikey: 811-1138-1-ND; MANUFACTURER: Murata Power Solutions Inc.; MPN: 29333C; VENDOR: Digikey; VLINK: https://www.digikey.com/product-detail/en/murata-power-solutions-inc/29333C/811-1138-1-ND/1924860; VPN: 811-1138-1-ND
L9-L13 L15 = openag-inductors:100UH_BOURNES: Bourne - FIXED IND 100UH 1.9A 180 MOHM Technical Specifications: Inductance: 100uH Rated Current: 1.9A Saturation Current: 3.0A DC Resistance: 180mΩ Operating Temperature: -40° C to 125°C Datasheet(s): 100uH Bourne <http://www.bourns.com/docs/Product-Datasheets/SDR1307.pdf> Vendors: Digikey: SDR1307-101KLCT-ND <https://www.digikey.com/product-detail/en/bourns-inc/SDR1307-101KL/SDR1307-101KLCT-ND/3437739>
LED+1 LED+3-LED+6 LED+8 LED-1 LED-3-LED-6 LED-8 NTC+ NTC+1 NTC- NTC-1 = solpad:SE14: SOLDER PAD E1553, drill 1,4mm, distributor Buerklin, 07F820
Q1-Q8 = transistor-npn:BCF30*: NPN Transistor
R1 R6-R9 R11 R13 R14 R28 = openag-resistors:1K-ERJ-PB3D1001V: RES SMD 1K OHM 0.5% 1/5W 0603 Description: 1 kOhms ±0.5% 0.2W, 1/5W Chip Resistor 0603 (1608 Metric) Automotive AEC-Q200, Pulse Withstanding Thick Film Technical Specifications: Resistance: 1 kOhms Tolerance: ±0.5% Power: 0.2W, 1/5W Operating Temperature: -55°C ~ 155°C Package / Case: 0603 (1608 Metric) Datasheet(s): ERJ-PB3, PB6 Series, High Precision Datasheet Vendor(s): Digikey: P20283CT-ND; MANUFACTURER: Panasonic; MPN: P20283CT-ND; VENDOR: Digikey; VLINK: https://www.digikey.com/product-detail/en/panasonic-electronic-components/ERJ-PB3D1001V/P20283CT-ND/6214538; VPN: P20283CT-ND
R2-R5 R10 R12 R15-R25 RB RB1 RB2 RC1 RC2 = rcl:R-US_: RESISTOR, American symbol; SPICEPREFIX: R
R29 = openag-resistors:0OHM-RC0603JR-070RL: RES SMD 0 OHM JUMPER 1/10W 0603 Description: 0 Ohms Jumper 0.1W, 1/10W Chip Resistor 0603 (1608 Metric) Moisture Resistant Thick Film Technical Specifications: Resistance: 0 Ohms Power: 0.1W, 1/10W Operating Temperature: -55°C ~ 155°C Package / Case: 0603 (1608 Metric) Datasheet(s): RC Series, L Datasheet Vendor(s): Digikey: 311-0.0GRCT-ND; MANUFACTURER: Yageo; MPN: RC0603JR-070RL; VENDOR: Digikey; VLINK: https://www.digikey.com/product-detail/en/yageo/RC0603JR-070RL/311-0.0GRCT-ND/729622; VPN: 311-0.0GRCT-ND
R31 R33-R35 = openag-resistors:600OHM-RC0603FR-07604RL: RES SMD 604 OHM 1% 1/10W 0603 Description: 604 Ohms ±1% 0.1W, 1/10W Chip Resistor 0603 (1608 Metric) Moisture Resistant Thick Film Technical Specifications: Resistance: 604 Ohms Tolerance: ±1% Power (Watts): 0.1W, 1/10W Composition: Thick Film Features: Moisture Resistant Temperature Coefficient: ±100ppm/°C Operating Temperature: -55°C ~ 155°C Package / Case: 0603 (1608 Metric) Supplier Device Package: 0603 Size / Dimension: 0.063" L x 0.032" W (1.60mm x 0.80mm) Height - Seated (Max): 0.022" (0.55mm) Number of Terminations: 2 Datasheet(s): RC Series, L Datasheet Chip Resistor Marking Vendor(s): Digikey: 311-604HRCT-ND; MANUFACTURER: Yageo; MPN: RC0603FR-07604RL; VENDOR: Digikey; VLINK: https://www.digikey.com/product-detail/en/yageo/RC0603FR-07604RL/311-604HRCT-ND/730276; VPN: 311-604HRCT-ND
R32 R36 = openag-resistors:120OHM-RC0603FR-07120RL: RES SMD 120 OHM 1% 1/10W 0603 Description: 120 Ohms ±1% 0.1W, 1/10W Chip Resistor 0603 (1608 Metric) Moisture Resistant Thick Film Technical Specifications: Resistance: 120 Ohms Tolerance: ±1% Power (Watts): 0.1W, 1/10W Composition: Thick Film Features: Moisture Resistant Temperature Coefficient: ±100ppm/°C Operating Temperature: -55°C ~ 155°C Package / Case: 0603 (1608 Metric) Supplier Device Package: 0603 Size / Dimension: 0.063" L x 0.032" W (1.60mm x 0.80mm) Height - Seated (Max): 0.022" (0.55mm) Number of Terminations: 2 Datasheet(s): RC Series, L Datasheet Chip Resistor Marking Vendor(s): Digikey: 311-120HRCT-ND; MANUFACTURER: Yageo; MPN: RC0603FR-07120RL; VENDOR: Digikey; VLINK: https://www.digikey.com/product-detail/en/yageo/RC0603FR-07120RL/311-120HRCT-ND/729867; VPN: 311-120HRCT-ND
R37 R38 = openag-resistors:2.2K-RC0603JR-072K2L: RES SMD 2.2K OHM 5% 1/10W 0603 Description: 2.2 kOhms ±5% 0.1W, 1/10W Chip Resistor 0603 (1608 Metric) Moisture Resistant Thick Film Technical Specifications: Resistance: 2.2 kOhms Tolerance: ±5% Power (Watts): 0.1W, 1/10W Composition: Thick Film Features: Moisture Resistant Temperature Coefficient: ±100ppm/°C Operating Temperature: -55°C ~ 155°C Package / Case: 0603 (1608 Metric) Supplier Device Package: 0603 Size / Dimension: 0.063" L x 0.032" W (1.60mm x 0.80mm) Height - Seated (Max): 0.022" (0.55mm) Number of Terminations: 2 Datasheet(s): RC Series, L Datasheet Chip Resistor Marking Vendor(s): Digikey: 311-2.2KGRCT-ND; MANUFACTURER: Yageo; MPN: RC0603JR-072K2L; VENDOR: Digikey; VLINK: https://www.digikey.com/product-detail/en/yageo/RC0603JR-072K2L/311-2.2KGRCT-ND/729676#; VPN: 311-2.2KGRCT-ND
R39 R41 = openag-resistors:100OHM-RC0603JR-07100RL: RES SMD 100 OHM 5% 1/10W 0603 Description: 100 Ohms ±5% 0.1W, 1/10W Chip Resistor 0603 (1608 Metric) Moisture Resistant Thick Film Technical Specifications: Resistance: 100 Ohms Tolerance: ±5% Power (Watts): 0.1W, 1/10W Composition: Thick Film Features: Moisture Resistant Temperature Coefficient: ±100ppm/°C Operating Temperature: -55°C ~ 155°C Package / Case: 0603 (1608 Metric) Supplier Device Package: 0603 Size / Dimension: 0.063" L x 0.032" W (1.60mm x 0.80mm) Height - Seated (Max): 0.022" (0.55mm) Number of Terminations: 2 Datasheet(s): Thick Film Chip Resistor Intro Chip Resistor Marking RC Series, L Datasheet Vendor(s): Digikey: 311-100GRCT-ND; MANUFACTURER: Yageo; MPN: RC0603JR-07100RL; VENDOR: Digikey; VLINK: https://www.digikey.com/product-detail/en/yageo/RC0603JR-07100RL/311-100GRCT-ND/729644; VPN: 311-100GRCT-ND
RS1 RS3-RS6 RS8 = openag-resistors:6.3OHM-RC0805FR-076R34L: Yageo - RC0805FR-076R34L - RES SMD 6.34 OHM 1% 1/8W 0805 Description: 6.34 Ohms ±1% 0.125W, 1/8W Chip Resistor 0805 (2012 Metric) Moisture Resistant Thick Film Technical Specifications: Resistance: 6.34 Ohms Tolerance: ±1% Power: 0.125W, 1/8W Temperature Coefficient: ±200ppm/°C Operating Temperature: -55°C ~ 155°C Packaging / Case: 0805 (2012 Metric) Datasheet(s): RC Series, L Datasheet Vendor(s): Digikey: 311-6.34CRCT-ND; POPULATE: YES; VERIFIED: NO
SJ1 = openag-connectors:EMI-BYPASS: EMI Bypass Solder Jumper; MPN: N/A
SJ_A16 SJ_A17 = openag-connectors:SOLDERJUMPER: SMD Solder JUMPER Solder the two pads together to create a connection, or remove the solder to break it. REFLOW - Use this footprint for solder paste and reflow ovens. WAVE - Use this footprint for hand-soldering (larger pads). CLOSED - Has a trace between the two pads to ensure it is closed by default. The trace needs to be cut to disable the jumper, and can be closed again by creating a solder bridge between the two pads.; MPN: N/A
TP1 TP2 TP10-TP39 TP42 TP44 TP45 TP48 TP49 TP51-TP65 TP73 TP74 TP80-TP84 = openag-testpads:TP: Test pad; MPN: N/A
U7 = openag-dacs:DAC5578SPW: IC DAC 8BIT I2C OCTAL 16TSSOP Description: 8 Bit Digital to Analog Converter 8 16-TSSOP Technical Specifications: Number of Bits: 8 Number of D/A Converters: 8 Settling Time: 12µs (Typ) Output Type: Voltage - Buffered Differential Output: No Data Interface: I²C Reference Type: External Voltage - Supply, Analog: 2.7 V ~ 5.5 V Voltage - Supply, Digital: 2.7 V ~ 5.5 V INL/DNL (LSB): ±0.01, ±0.01 Architecture: String DAC Operating Temperature: -40°C ~ 125°C Package / Case: 16-TSSOP (0.173", 4.40mm Width) Supplier Device Package: 16-TSSOP Base Part Number: DAC5578 Datasheet(s): DAC5578,6578,7578 Analog Signal Chain Guide Vendor(s): Digikey: 296-27736-5-ND; MANUFACTURER: Texas Instruments; MPN: DAC5578SPW; VENDOR: Digikey; VLINK: https://www.digikey.com/product-detail/en/texas-instruments/DAC5578SPW/296-27736-5-ND/2360827; VPN: 296-27736-5-ND
U11 = openag-buffers:PCA9615DPJ: IC REDRIVER I2C 2CH 10TSSOP Description: Buffer, ReDriver 2 Channel 400kHz 10-TSSOP Technical Specifications: Type: Buffer, ReDriver Applications: I²C Input: 2-Wire Bus Output: 2-Wire Bus Data Rate (Max): 400kHz Number of Channels: 2 Capacitance - Input: 7pF Voltage - Supply: 2.3 V ~ 5.5 V Current - Supply: 16µA Operating Temperature: -40°C ~ 85°C Package / Case: 10-TFSOP, 10-MSOP (0.118", 3.00mm Width) Supplier Device Package: 10-TSSOP Base Part Number: PCA9615 Datasheet(s): PCA9615DP Vendor(s): Digikey: 568-11484-1-ND; MANUFACTURER: NXP USA Inc.; MPN: PCA9615DPJ; VENDOR: Digikey; VLINK: https://www.digikey.com/product-detail/en/nxp-usa-inc/PCA9615DPJ/568-11484-1-ND/4864508; VPN: 568-11484-1-ND
U13 = openag-regulators:LM2937IMP-3.3/NOPB: IC REG LIN 3.3V 400MA SOT223-4 Description: Linear Voltage Regulator IC Positive Fixed 1 Output 3.3V 400mA SOT-223-4 Technical Specifications: Output Configuration: Positive Output Type: Fixed Number of Regulators: 1 Voltage - Input (Max): 26V Voltage - Output (Min/Fixed): 3.3V Voltage Dropout (Max): 1V @ 50mA Current - Output: 400mA Current - Quiescent (Iq): 2mA Current - Supply (Max): 1.25A Protection Features: Over Temperature, Reverse Polarity, Short Circuit Operating Temperature: -40°C ~ 85°C Mounting Type: Surface Mount Package / Case: TO-261-4, TO-261AA Supplier Device Package: SOT-223-4 Base Part Number: LM2937 Datasheet(s): LM2937-2.5, LM2937-3.3 Datasheet Vendor(s): Digikey: LM2937IMP-3.3/NOPBCT-ND; MANUFACTURER: Texas Instruments; MPN: LM2937IMP-3.3/NOPB; VENDOR: Digikey; VLINK: https://www.digikey.com/product-detail/en/texas-instruments/LM2937IMP-3.3-NOPB/LM2937IMP-3.3-NOPBCT-ND/270742#; VPN: LM2937IMP-3.3/NOPBCT-ND
U17 = openag-regulators:R-78E5.0-1.0: DC/DC CONVERTER 5V 5W Description: Linear Regulator Replacement DC DC Converter 1 Output 5V 1A 8V - 28V Input Technical Specifications: Type: Linear Regulator Replacement Number of Outputs: 1 Voltage - Input (Min): 8V Voltage - Input (Max): 28V Voltage - Output 1: 5V Current - Output (Max): 1A Power (Watts): 5W Applications: ITE (Commercial) Features: SCP Operating Temperature: -40°C ~ 85°C Efficiency: 91% Mounting Type: Through Hole Package / Case: 3-SIP Module Size / Dimension: 0.46" L x 0.33" W x 0.41" H (11.6mm x 8.5mm x 10.4mm) Datasheet(s): R-78E-1.0 Series Datasheet Vendor(s): Digikey: 945-2201-ND; MANUFACTURER: Recom Power; MPN: R-78E5.0-1.0; VENDOR: Digikey; VLINK: https://www.digikey.com/product-detail/en/recom-power/R-78E5.0-1.0/945-2201-ND/4930585; VPN: 945-2201-ND
U$6 = openag-frames:AUTHOR; AUTHOR: DP, SN; MPN: N/A
U$7 = openag-frames:TITLE; MPN: N/A; TITLE: Light Controller; URL: github.com/openaginitiative/openag_eagle/proj/light-controller; VER: 4.0
U$11-U$15 U$17 = openag-driver-IC:AL8861: AL8861 LED Driver IC Description: IC LED DRVR REG PWM 1.5A SOT89-5 Technical Specifications: Type: IC Voltage In: 4.5V - 40V Current Out: Up to 1.5A Frequency: 1Mhz Dimming: PWM or Analog Package SOT-89-5 Operating Temperature: -40°C ~ 85°C (TA) Datasheet(s): Diodes AL8861 Vendor(s): Digikey: Diodes AL8861

## Net classes
0 default: width 0.305 mm, drill 0.254 mm, clearance 0.254 mm